# EAGLE schematic Adj (EAGLE 6.5.0)
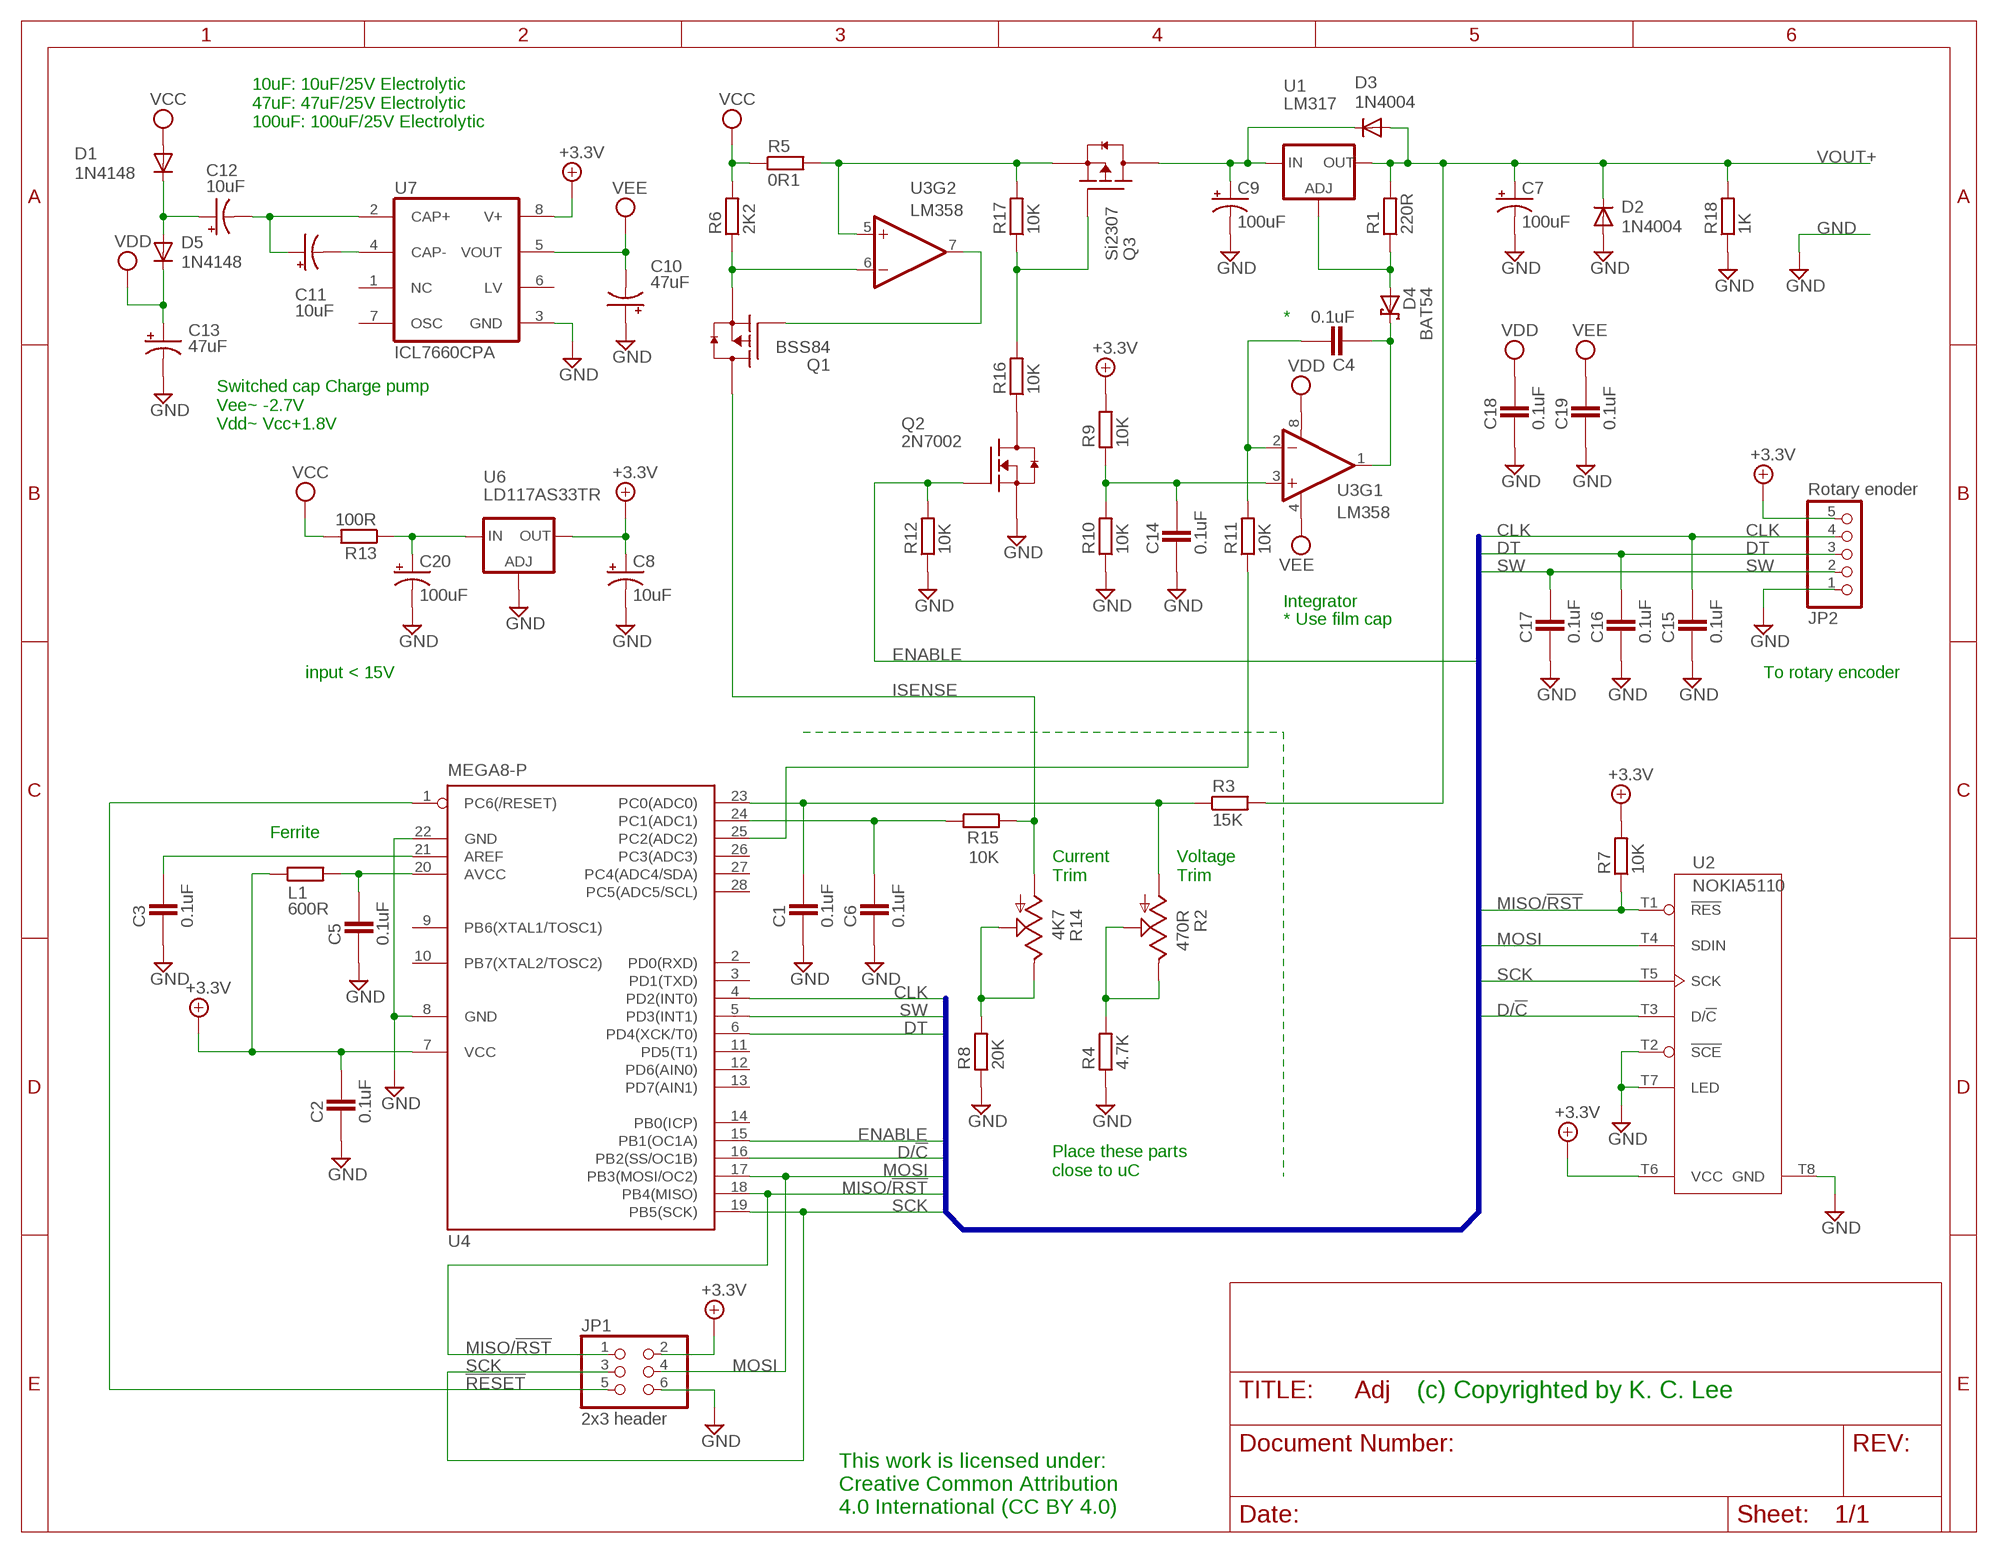
[diagram p0: schematic, sheet 1]

## Parts
C1  0.1uF  CAPACITOR_0805  [CAPC2012X145AN]
C2  0.1uF  CAPACITOR_0805  [CAPC2012X145AN]
C3  0.1uF  CAPACITOR_0805  [CAPC2012X145AN]
C4  0.1uF  CAPACITOR_0805  [CAPC2012X145AN]
C5  0.1uF  CAPACITOR_0805  [CAPC2012X145AN]
C6  0.1uF  CAPACITOR_0805  [CAPC2012X145AN]
C7  100uF  CAP_POL  [E2,5-6E]
C8  10uF  CAP_POL  [E2,5-6E]
C9  100uF  CAP_POL  [E2,5-6E]
C10  47uF  CAP_POL  [E2,5-6E]
C11  10uF  CAP_POL  [E2,5-6E]
C12  10uF  CAP_POL  [E2,5-6E]
C13  47uF  CAP_POL  [E2,5-6E]
C14  0.1uF  CAPACITOR_0805  [CAPC2012X145AN]
C15  0.1uF  CAPACITOR_0805  [CAPC2012X145AN]
C16  0.1uF  CAPACITOR_0805  [CAPC2012X145AN]
C17  0.1uF  CAPACITOR_0805  [CAPC2012X145AN]
C18  0.1uF  CAPACITOR_0805  [CAPC2012X145AN]
C19  0.1uF  CAPACITOR_0805  [CAPC2012X145AN]
C20  100uF  CAP_POL  [E2,5-6E]
D1  1N4148  1N4148DO35-7  [DO35-7]
D2  1N4004  [DO41-10]
D3  1N4004  [DO41-10]
D4  BAT54  SCHOTTKY_SOT-23  [SOT95P280X135-3N]
D5  1N4148  1N4148DO35-7  [DO35-7]
JP1  2x3 header  PINHD-2X3_2.54  [2X03]
JP2  Rotary enoder  PINHD-1X5_2.54  [1X05]
L1  600R  RESISTOR_0603  [RESC1608X55N]
Q1  BSS84  MOSFET-PCH_SOT-23  [SOT95P280X135-3N]
Q2  2N7002  MOSFET-NCH_SOT-23  [SOT95P280X135-3N]
Q3  Si2307  MOSFET-PCH_SOT-23  [SOT95P280X135-3N]
R1  220R  RESISTOR_0603  [RESC1608X55N]
R2  470R  TRIM_US-B25U  [B25U]
R3  15K  RESISTOR_0603  [RESC1608X55N]
R4  4.7K  RESISTOR_0603  [RESC1608X55N]
R5  0R1  RESISTOR_0603  [RESC1608X55N]
R6  2K2  RESISTOR_0603  [RESC1608X55N]
R7  10K  RESISTOR_0603  [RESC1608X55N]
R8  20K  RESISTOR_0603  [RESC1608X55N]
R9  10K  RESISTOR_0603  [RESC1608X55N]
R10  10K  RESISTOR_0603  [RESC1608X55N]
R11  10K  RESISTOR_0603  [RESC1608X55N]
R12  10K  RESISTOR_0603  [RESC1608X55N]
R13  100R  RESISTOR_0603  [RESC1608X55N]
R14  4K7  TRIM_US-B25U  [B25U]
R15  10K  RESISTOR_0603  [RESC1608X55N]
R16  10K  RESISTOR_0603  [RESC1608X55N]
R17  10K  RESISTOR_0603  [RESC1608X55N]
R18  1K  RESISTOR_0603  [RESC1608X55N]
U1  LM317  V_REG_317SINK  [TO220-ADJ]
U2  NOKIA5110  NOKIA5110ALT-TOP  [NOKIA5110-ALT-TOP]
U3  LM358  [DIP08]
U4  MEGA8-P  [DIL28-3]
U6  LD117AS33TR  [SOT223]
U7  ICL7660CPA  [DIL08]

## Nets
!RESET: JP1.5 U4.1(PC6(/RESET))
+3.3V: C2.2 C8.+ JP1.2 JP2.5 L1.1 R7.2 R9.2 U2.T6(VCC) U4.7(VCC) U6.2(OUT) U6.4(OUT) U7.8(V+)
CLK: C15.2 JP2.4 U4.4(PD2(INT0))
D/!C: U2.T3(D/!C) U4.16(PB2(SS/OC1B))
DT: C16.2 JP2.3 U4.6(PD4(XCK/T0))
ENABLE: Q2.1(G) R12.2 U4.15(PB1(OC1A))
GND: C1.1 C2.1 C3.1 C5.1 C6.1 C7.- C8.- C9.- C10.+ C13.- C14.1 C15.1 C16.1 C17.1 C18.1 C19.1 C20.- D2.A JP1.6 JP2.1 Q2.2(S) R4.1 R8.1 R10.1 R12.1 R18.1 U2.T2(!SCE) U2.T7(LED) U2.T8(GND) U4.8(GND) U4.22(GND) U6.1(ADJ) U7.3(GND)
ISENSE: Q1.3(D) R14.A R15.1
MISO/!RST: JP1.1 R7.1 U2.T1(!RES) U4.18(PB4(MISO))
MOSI: JP1.4 U2.T4(SDIN) U4.17(PB3(MOSI/OC2))
N$1: C5.2 L1.2 U4.20(AVCC)
N$2: C4.1 D4.3(K) U3.1(OUT)
N$3: C20.+ R13.1 U6.3(IN)
N$4: R2.E R2.S R4.2
N$5: C1.2 R2.A R3.1 U4.23(PC0(ADC0))
N$6: C4.2 R11.2 U3.2(-IN)
N$7: C9.+ D3.C Q3.3(D) U1.IN
N$8: Q1.2(S) R6.1 U3.6(-IN)
N$10: C3.2 U4.21(AREF)
N$11: C6.2 R15.2 U4.24(PC1(ADC1))
N$12: C11.- U7.4(CAP-)
N$13: C11.+ C12.- U7.2(CAP+)
N$14: C12.+ D1.C D5.A
N$15: Q1.1(G) U3.7(OUT)
N$16: C14.2 R9.1 R10.2 U3.3(+IN)
N$17: R11.1 U4.25(PC2(ADC2))
N$18: Q3.2(S) R5.2 R17.2 U3.5(+IN)
N$19: R8.2 R14.E R14.S
N$20: Q2.3(D) R16.1
N$21: Q3.1(G) R16.2 R17.1
N$22: D4.1(A) R1.1 U1.ADJ
SCK: JP1.3 U2.T5(SCK) U4.19(PB5(SCK))
SW: C17.2 JP2.2 U4.5(PD3(INT1))
VCC: D1.A R5.1 R6.2 R13.2
VDD: C13.+ C18.2 D5.C U3.8(V+)
VEE: C10.- C19.2 U3.4(V-) U7.5(VOUT)
VOUT+: C7.+ D2.C D3.A R1.2 R3.2 R18.2 U1.OUT
Unconnected: U4.2(PD0(RXD)) U4.3(PD1(TXD)) U4.9(PB6(XTAL1/TOSC1)) U4.10(PB7(XTAL2/TOSC2)) U4.11(PD5(T1)) U4.12(PD6(AIN0)) U4.13(PD7(AIN1)) U4.14(PB0(ICP)) U4.26(PC3(ADC3)) U4.27(PC4(ADC4/SDA)) U4.28(PC5(ADC5/SCL)) U7.1(NC) U7.6(LV) U7.7(OSC)

## Buses
B$1

## Notes on the sheet
- 10uF: 10uF/25V Electrolytic
  47uF: 47uF/25V Electrolytic
  100uF: 100uF/25V Electrolytic
- *
- Switched cap Charge pump
  Vee~ -2.7V
  Vdd~ Vcc+1.8V
- Integrator
- * Use film cap
- input < 15V | To rotary encoder
- Ferrite
- Current
  Trim
- Voltage
  Trim
- Place these parts 
  close to uC
- (c) Copyrighted by K. C. Lee
- This work is licensed under:
  Creative Common Attribution 
  4.0 International (CC BY 4.0)

## Library data of the parts
C1-C6 C14-C19 = ipc-7351-capacitor:CAPACITOR_; PARTNO: *
C7 C9 C20 = Misc Passives:CAP_POL: Capacitor Polarized These are standard SMD and PTH capacitors. Normally 10uF, 47uF, and 100uF in electrolytic and tantalum varieties. Always verify the external diameter of the through hole cap, it varies with capacity, voltage, and manufacturer. The EIA devices should be standard.; PARTNO: 100uF/25V
C8 C11 C12 = Misc Passives:CAP_POL: Capacitor Polarized These are standard SMD and PTH capacitors. Normally 10uF, 47uF, and 100uF in electrolytic and tantalum varieties. Always verify the external diameter of the through hole cap, it varies with capacity, voltage, and manufacturer. The EIA devices should be standard.; PARTNO: 10uF/25V
C10 C13 = Misc Passives:CAP_POL: Capacitor Polarized These are standard SMD and PTH capacitors. Normally 10uF, 47uF, and 100uF in electrolytic and tantalum varieties. Always verify the external diameter of the through hole cap, it varies with capacity, voltage, and manufacturer. The EIA devices should be standard.; PARTNO: 47uF/25V
D1 D5 = diode:1N4148: DIODE high speed (Philips); PARTNO: *
D2 D3 = diode:1N4004: DIODE general purpose rectifier, 1 A; PARTNO: *
D4 = ipc-7351-diode:SCHOTTKY_; PARTNO: *
JP1 = Misc Conn:PINHD-2X3: PIN HEADER; PARTNO: *
JP2 = Misc Conn:PINHD-1X5: PIN HEADER; PARTNO: *
L1 = ipc-7351-resistor:RESISTOR_; PARTNO: Ferrite 600R@100MHz
Q1 Q3 = ipc-7351-transistor:MOSFET-PCH_; PARTNO: *
Q2 = ipc-7351-transistor:MOSFET-NCH_; PARTNO: *
R1 R3 R4 R6-R13 R15-R18 = ipc-7351-resistor:RESISTOR_; PARTNO: *
R2 R14 = pot:TRIM_US-: POTENTIOMETER; PARTNO: *
R5 = ipc-7351-resistor:RESISTOR_; PARTNO: 0R1 1W
U1 = SparkFun-PowerIC:V_REG_317: Voltage Regulator Standard LM317 adjustable voltage regulator. AOI (Adjust Output Input). Google 'LM317 Calculator' for easy to use app to get the two resistor values needed. 240/720 for 5V output. 240/390 for 3.3V output. Spark Fun Electronics SKU : COM-00527; PARTNO: *
U2 = Misc opto:NOKIA5110: DX Nokia 5110 LCD 84x48; PARTNO: Nokia 5110 LCD
U3 = SparkFun-AnalogIC:LM358: Jellybean op-amp; PARTNO: *; PROD_ID: IC-09172
U4 = atmel:MEGA8-P: MICROCONTROLLER 8 Kbytes FLASH, 1 kbytes SRAM, 512 bytes EEPROM, USART, 4-channel 10 bit ADC, 2-channel 8 bit ADC Pin compatible with Atmega48, ATMega88, ATMega168 Source: avr.lbr; OC_FARNELL: unknown; OC_NEWARK: unknown; PARTNO: ATMerga8A
U6 = Misc Power:LD117A?*: Low drop fixed and adjustable positive voltage regulators 1 A Source: http://www.st.com/stonline/products/literature/ds/7194/ld1117axx.pdf; PARTNO: *
U7 = Misc Power:ICL7660CPA: VOLTAGE CONVERTER; MF: INTERSIL; MPN: ICL7660CPA; OC_FARNELL: 1018170; OC_NEWARK: 06F7441; PARTNO: ICL7660CPA